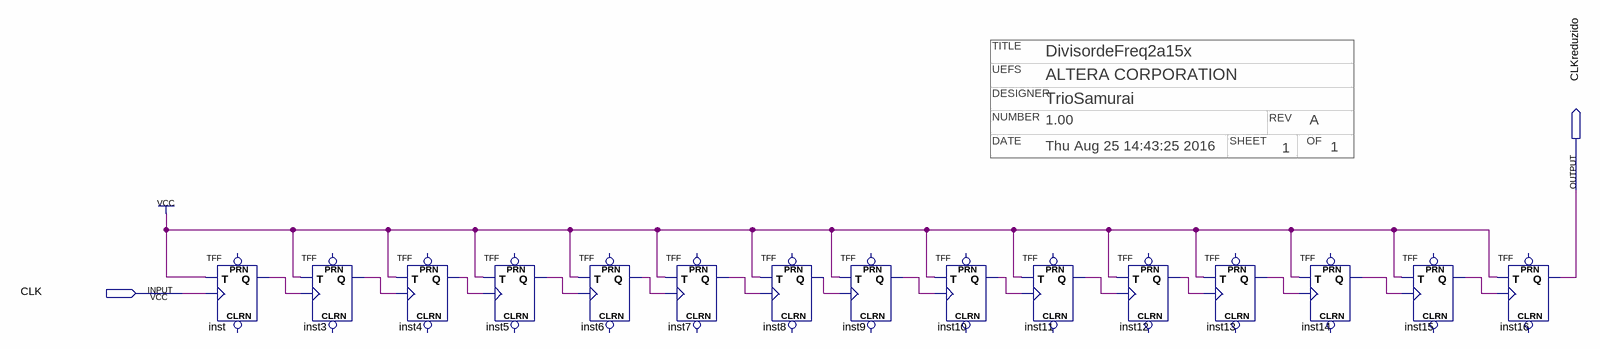
[diagram p0: schematic sheet]
// Quartus schematic divisordefreq.bdf as structural Verilog: 15 symbols, 2 pins
// Title block: TITLE: DivisordeFreq2a15x; UEFS: ALTERA CORPORATION; DESIGNER: TrioSamurai; NUMBER: 1.00; REV: A; DATE: Thu Aug 25 14:43:25 2016; SHEET: 1; OF: 1
module divisordefreq (
  input  CLK,
  output CLKreduzido
);

  wire inst3_q, inst4_q, inst5_q, inst6_q, inst7_q, inst8_q, inst9_q, inst10_q, inst11_q, inst12_q, inst13_q,
       inst14_q, inst15_q, inst_q;

  TFF inst (.T(1'b1), .CLK(CLK), .Q(inst_q));  // open: PRN, CLRN
  TFF inst3 (.T(1'b1), .CLK(inst_q), .Q(inst3_q));  // open: PRN, CLRN
  TFF inst4 (.T(1'b1), .CLK(inst3_q), .Q(inst4_q));  // open: PRN, CLRN
  TFF inst5 (.T(1'b1), .CLK(inst4_q), .Q(inst5_q));  // open: PRN, CLRN
  TFF inst6 (.T(1'b1), .CLK(inst5_q), .Q(inst6_q));  // open: PRN, CLRN
  TFF inst7 (.T(1'b1), .CLK(inst6_q), .Q(inst7_q));  // open: PRN, CLRN
  TFF inst8 (.T(1'b1), .CLK(inst7_q), .Q(inst8_q));  // open: PRN, CLRN
  TFF inst9 (.T(1'b1), .CLK(inst8_q), .Q(inst9_q));  // open: PRN, CLRN
  TFF inst10 (.T(1'b1), .CLK(inst9_q), .Q(inst10_q));  // open: PRN, CLRN
  TFF inst11 (.T(1'b1), .CLK(inst10_q), .Q(inst11_q));  // open: PRN, CLRN
  TFF inst12 (.T(1'b1), .CLK(inst11_q), .Q(inst12_q));  // open: PRN, CLRN
  TFF inst13 (.T(1'b1), .CLK(inst12_q), .Q(inst13_q));  // open: PRN, CLRN
  TFF inst14 (.T(1'b1), .CLK(inst13_q), .Q(inst14_q));  // open: PRN, CLRN
  TFF inst15 (.T(1'b1), .CLK(inst14_q), .Q(inst15_q));  // open: PRN, CLRN
  TFF inst16 (.T(1'b1), .CLK(inst15_q), .Q(CLKreduzido));  // open: PRN, CLRN
endmodule
